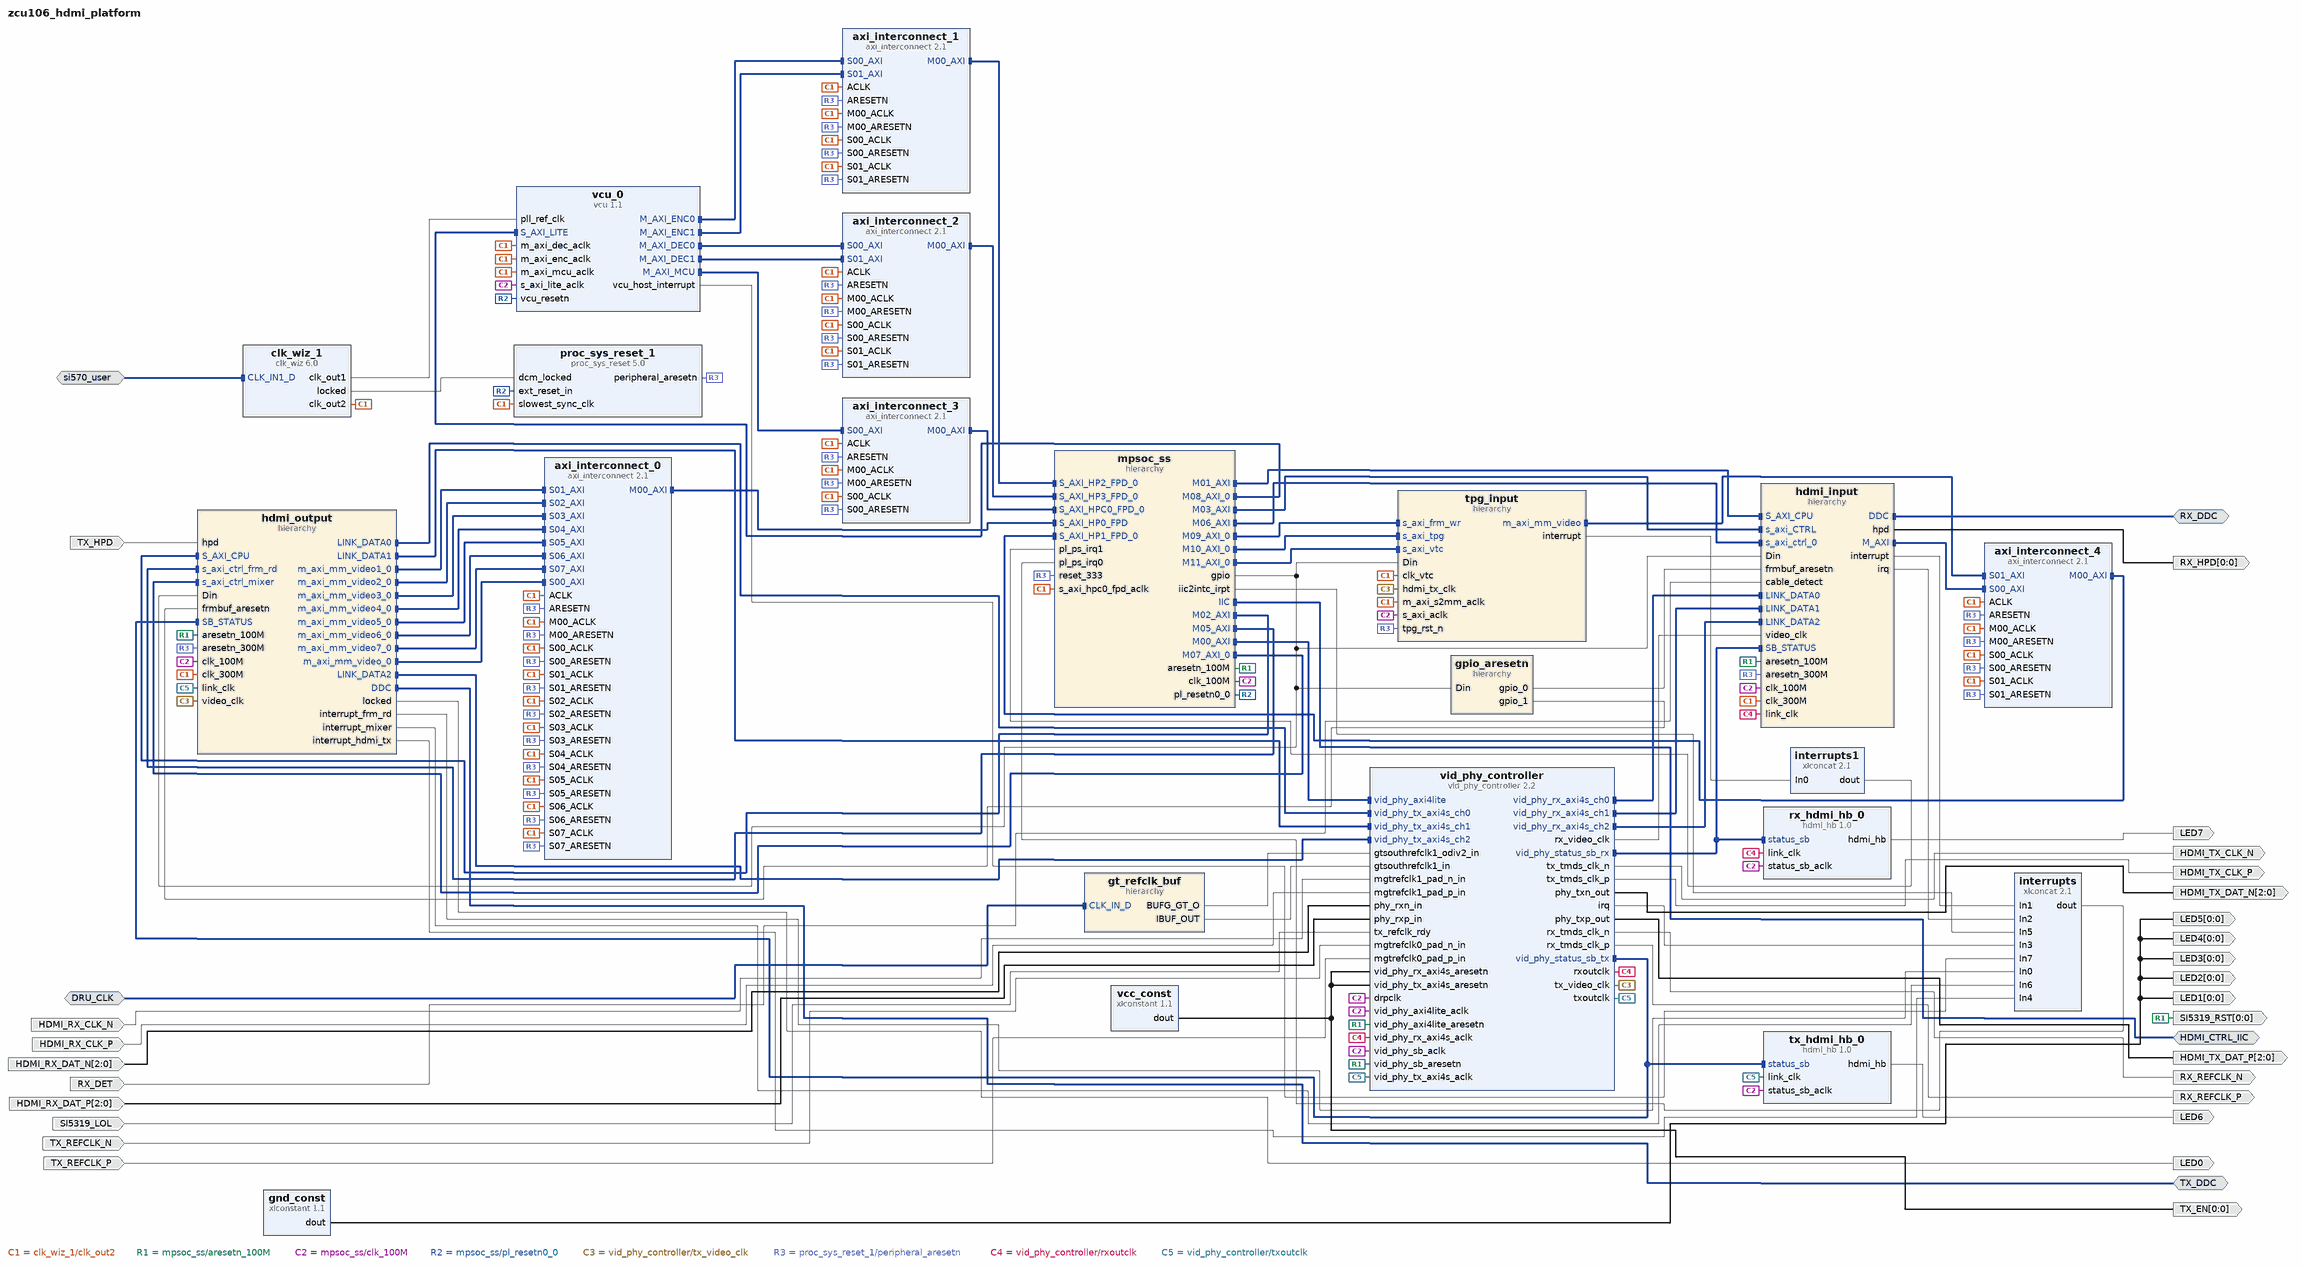
[diagram p0: block diagram of the top level]
# Vivado block design zcu106_hdmi_platform, xczu7ev-ffvc1156-2-e, Vivado 2018.1
create_bd_design zcu106_hdmi_platform

create_bd_intf_port -mode Slave -vlnv xilinx.com:interface:diff_clock_rtl:1.0 DRU_CLK
set_property -dict {CONFIG.FREQ_HZ 156250000} [get_bd_intf_ports DRU_CLK]
create_bd_intf_port -mode Master -vlnv xilinx.com:interface:iic_rtl:1.0 HDMI_CTRL_IIC
create_bd_intf_port -mode Master -vlnv xilinx.com:interface:iic_rtl:1.0 RX_DDC
create_bd_intf_port -mode Master -vlnv xilinx.com:interface:iic_rtl:1.0 TX_DDC
create_bd_intf_port -mode Slave -vlnv xilinx.com:interface:diff_clock_rtl:1.0 si570_user
set_property -dict {CONFIG.FREQ_HZ 300000000} [get_bd_intf_ports si570_user]
create_bd_port -dir I HDMI_RX_CLK_N
create_bd_port -dir I HDMI_RX_CLK_P
create_bd_port -dir I -from 2 -to 0 HDMI_RX_DAT_N
create_bd_port -dir I -from 2 -to 0 HDMI_RX_DAT_P
create_bd_port -dir O HDMI_TX_CLK_N
create_bd_port -dir O HDMI_TX_CLK_P
create_bd_port -dir O -from 2 -to 0 HDMI_TX_DAT_N
create_bd_port -dir O -from 2 -to 0 HDMI_TX_DAT_P
create_bd_port -dir O LED0
create_bd_port -dir O -from 0 -to 0 LED1
create_bd_port -dir O -from 0 -to 0 LED2
create_bd_port -dir O -from 0 -to 0 LED3
create_bd_port -dir O -from 0 -to 0 LED4
create_bd_port -dir O -from 0 -to 0 LED5
create_bd_port -dir O LED6
create_bd_port -dir O LED7
create_bd_port -dir I RX_DET
create_bd_port -dir O -from 0 -to 0 RX_HPD
create_bd_port -dir O RX_REFCLK_N
create_bd_port -dir O RX_REFCLK_P
create_bd_port -dir I SI5319_LOL
create_bd_port -dir O -from 0 -to 0 SI5319_RST
create_bd_port -dir O -from 0 -to 0 TX_EN
create_bd_port -dir I TX_HPD
create_bd_port -dir I TX_REFCLK_N
create_bd_port -dir I TX_REFCLK_P

create_bd_cell -type ip -vlnv xilinx.com:ip:axi_interconnect:2.1 axi_interconnect_0
set_property -dict {CONFIG.NUM_SI 8 CONFIG.NUM_MI 1} [get_bd_cells axi_interconnect_0]
create_bd_cell -type ip -vlnv xilinx.com:ip:axi_interconnect:2.1 axi_interconnect_1
set_property -dict [list \
  CONFIG.NUM_SI 2 \
  CONFIG.NUM_MI 1 \
  CONFIG.M00_HAS_REGSLICE 4 \
  CONFIG.S00_HAS_REGSLICE 4 \
  CONFIG.S01_HAS_REGSLICE 4 \
] [get_bd_cells axi_interconnect_1]
create_bd_cell -type ip -vlnv xilinx.com:ip:axi_interconnect:2.1 axi_interconnect_2
set_property -dict [list \
  CONFIG.NUM_SI 2 \
  CONFIG.NUM_MI 1 \
  CONFIG.M00_HAS_REGSLICE 4 \
  CONFIG.S00_HAS_REGSLICE 4 \
  CONFIG.S01_HAS_REGSLICE 4 \
] [get_bd_cells axi_interconnect_2]
create_bd_cell -type ip -vlnv xilinx.com:ip:axi_interconnect:2.1 axi_interconnect_3
set_property -dict [list \
  CONFIG.NUM_SI 1 \
  CONFIG.NUM_MI 1 \
  CONFIG.M00_HAS_REGSLICE 4 \
  CONFIG.S00_HAS_REGSLICE 4 \
  CONFIG.S01_HAS_REGSLICE 4 \
] [get_bd_cells axi_interconnect_3]
create_bd_cell -type ip -vlnv xilinx.com:ip:axi_interconnect:2.1 axi_interconnect_4
set_property -dict [list \
  CONFIG.NUM_SI 2 \
  CONFIG.NUM_MI 1 \
  CONFIG.M00_HAS_REGSLICE 4 \
  CONFIG.S00_HAS_REGSLICE 4 \
  CONFIG.S01_HAS_REGSLICE 4 \
] [get_bd_cells axi_interconnect_4]
create_bd_cell -type ip -vlnv xilinx.com:ip:clk_wiz:6.0 clk_wiz_1
set_property -dict [list \
  CONFIG.ENABLE_CLOCK_MONITOR false \
  CONFIG.PRIMITIVE MMCM \
  CONFIG.USE_PHASE_ALIGNMENT true \
  CONFIG.PRIM_IN_FREQ 300.000 \
  CONFIG.USE_INCLK_SWITCHOVER false \
  CONFIG.SECONDARY_SOURCE Single_ended_clock_capable_pin \
  CONFIG.JITTER_OPTIONS PS \
  CONFIG.CLKIN1_UI_JITTER 100.000 \
  CONFIG.CLKIN2_UI_JITTER 100.000 \
  CONFIG.CLKIN1_JITTER_PS 100.000 \
  CONFIG.CLKIN2_JITTER_PS 100.000 \
  CONFIG.CLKOUT2_USED true \
  CONFIG.CLKOUT3_USED true \
  CONFIG.NUM_OUT_CLKS 3 \
  CONFIG.CLKOUT1_REQUESTED_OUT_FREQ 33.33 \
  CONFIG.CLKOUT2_REQUESTED_OUT_FREQ 330 \
  CONFIG.CLKOUT3_REQUESTED_OUT_FREQ 200.000 \
  CONFIG.PRIM_SOURCE Differential_clock_capable_pin \
  CONFIG.USE_RESET false \
  CONFIG.MMCM_DIVCLK_DIVIDE 29 \
  CONFIG.MMCM_CLKFBOUT_MULT_F 96.250 \
  CONFIG.MMCM_CLKIN1_PERIOD 3.333 \
  CONFIG.MMCM_CLKIN2_PERIOD 10.0 \
  CONFIG.MMCM_REF_JITTER1 0.030 \
  CONFIG.MMCM_REF_JITTER2 0.010 \
  CONFIG.MMCM_CLKOUT0_DIVIDE_F 29.875 \
  CONFIG.MMCM_CLKOUT1_DIVIDE 3 \
  CONFIG.MMCM_CLKOUT2_DIVIDE 5 \
  CONFIG.CLKOUT1_JITTER 354.447 \
  CONFIG.CLKOUT1_PHASE_ERROR 467.254 \
  CONFIG.CLKOUT2_JITTER 261.654 \
  CONFIG.CLKOUT2_PHASE_ERROR 467.254 \
  CONFIG.CLKOUT3_JITTER 277.891 \
  CONFIG.CLKOUT3_PHASE_ERROR 467.254 \
] [get_bd_cells clk_wiz_1]
create_bd_cell -type ip -vlnv xilinx.com:ip:xlconstant:1.1 gnd_const
set_property -dict {CONFIG.CONST_VAL 0} [get_bd_cells gnd_const]
create_bd_cell -type hier gpio_aresetn
create_bd_cell -type hier gt_refclk_buf
create_bd_cell -type hier hdmi_input
create_bd_cell -type hier hdmi_output
create_bd_cell -type ip -vlnv xilinx.com:ip:xlconcat:2.1 interrupts
set_property -dict {CONFIG.NUM_PORTS 8} [get_bd_cells interrupts]
create_bd_cell -type ip -vlnv xilinx.com:ip:xlconcat:2.1 interrupts1
set_property -dict {CONFIG.NUM_PORTS 1} [get_bd_cells interrupts1]
create_bd_cell -type hier mpsoc_ss
create_bd_cell -type ip -vlnv xilinx.com:ip:proc_sys_reset:5.0 proc_sys_reset_1
create_bd_cell -type ip -vlnv xilinx.com:user:hdmi_hb:1.0 rx_hdmi_hb_0
create_bd_cell -type hier tpg_input
create_bd_cell -type ip -vlnv xilinx.com:user:hdmi_hb:1.0 tx_hdmi_hb_0
create_bd_cell -type ip -vlnv xilinx.com:ip:xlconstant:1.1 vcc_const
set_property -dict {CONFIG.CONST_VAL 1} [get_bd_cells vcc_const]
create_bd_cell -type ip -vlnv xilinx.com:ip:vcu:1.1 vcu_0
set_property -dict [list \
  CONFIG.ENC_CODING_TYPE 1 \
  CONFIG.ENC_COLOR_FORMAT 0 \
  CONFIG.ENC_COLOR_DEPTH 0 \
  CONFIG.ENC_BUFFER_EN true \
  CONFIG.ENC_BUFFER_SIZE_ACTUAL 1445 \
  CONFIG.ENC_BUFFER_MOTION_VEC_RANGE 1 \
  CONFIG.ENC_BUFFER_B_FRAME 1 \
  CONFIG.ENC_MEM_URAM_USED 1445 \
  CONFIG.TABLE_NO 2 \
] [get_bd_cells vcu_0]
create_bd_cell -type ip -vlnv xilinx.com:ip:vid_phy_controller:2.2 vid_phy_controller
set_property -dict [list \
  CONFIG.CHANNEL_ENABLE {X0Y0 X0Y1 X0Y2} \
  CONFIG.CHANNEL_SITE X0Y0 \
  CONFIG.Tx_GT_Line_Rate 5.94 \
  CONFIG.Tx_GT_Ref_Clock_Freq 297 \
  CONFIG.Rx_GT_Line_Rate 5.94 \
  CONFIG.Rx_GT_Ref_Clock_Freq 297 \
  CONFIG.C_Tx_Protocol HDMI \
  CONFIG.C_Rx_Protocol HDMI \
  CONFIG.C_TX_REFCLK_SEL 0 \
  CONFIG.C_RX_REFCLK_SEL 1 \
  CONFIG.C_NIDRU_REFCLK_SEL 5 \
  CONFIG.C_TX_PLL_SELECTION 6 \
  CONFIG.C_RX_PLL_SELECTION 0 \
  CONFIG.C_NIDRU true \
  CONFIG.C_vid_phy_tx_axi4s_ch_TDATA_WIDTH 20 \
  CONFIG.C_vid_phy_tx_axi4s_ch_INT_TDATA_WIDTH 20 \
  CONFIG.C_vid_phy_tx_axi4s_ch_TUSER_WIDTH 1 \
  CONFIG.C_vid_phy_rx_axi4s_ch_TDATA_WIDTH 20 \
  CONFIG.C_vid_phy_rx_axi4s_ch_INT_TDATA_WIDTH 20 \
  CONFIG.C_vid_phy_rx_axi4s_ch_TUSER_WIDTH 1 \
  CONFIG.C_INPUT_PIXELS_PER_CLOCK 2 \
  CONFIG.C_Use_Oddr_for_Tmds_Clkout true \
  CONFIG.C_Txrefclk_Rdy_Invert true \
  CONFIG.C_INT_HDMI_VER_CMPTBLE 3 \
  CONFIG.C_FOR_UPGRADE_ARCHITECTURE placeholder \
  CONFIG.C_FOR_UPGRADE_DEVICE placeholder \
  CONFIG.C_FOR_UPGRADE_PART placeholder \
  CONFIG.C_FOR_UPGRADE_PACKAGE placeholder \
  CONFIG.C_FOR_UPGRADE_SPEEDGRADE 0 \
  CONFIG.C_FOR_UPGRADE_MAXOPTVOL 0.00 \
  CONFIG.C_FOR_UPGRADE_REFVOL 0.00 \
] [get_bd_cells vid_phy_controller]

# ---- hierarchy /gpio_aresetn ----
current_bd_instance /gpio_aresetn
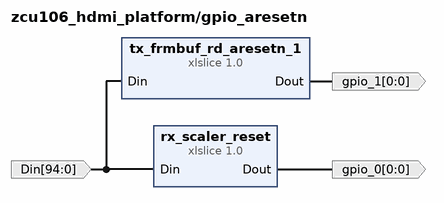
[diagram p1: block diagram inside /gpio_aresetn]
create_bd_pin -dir I -from 94 -to 0 Din
create_bd_pin -dir O -from 0 -to 0 -type rst gpio_0
create_bd_pin -dir O -from 0 -to 0 gpio_1

create_bd_cell -type ip -vlnv xilinx.com:ip:xlslice:1.0 rx_scaler_reset
set_property -dict {CONFIG.DIN_TO 0 CONFIG.DIN_FROM 0 CONFIG.DIN_WIDTH 95 CONFIG.DOUT_WIDTH 1} [get_bd_cells rx_scaler_reset]
create_bd_cell -type ip -vlnv xilinx.com:ip:xlslice:1.0 tx_frmbuf_rd_aresetn_1
set_property -dict [list \
  CONFIG.DIN_TO 1 \
  CONFIG.DIN_FROM 1 \
  CONFIG.DIN_WIDTH 95 \
  CONFIG.DOUT_WIDTH 1 \
] [get_bd_cells tx_frmbuf_rd_aresetn_1]

# ---- hierarchy /gt_refclk_buf ----
current_bd_instance /gt_refclk_buf
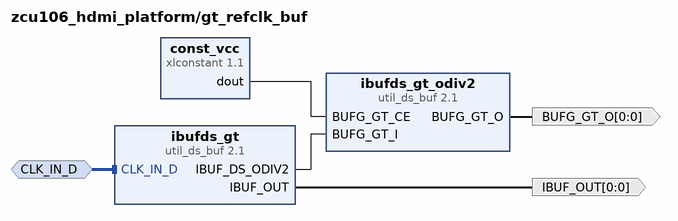
[diagram p2: block diagram inside /gt_refclk_buf]
create_bd_intf_pin -mode Slave -vlnv xilinx.com:interface:diff_clock_rtl:1.0 CLK_IN_D
create_bd_pin -dir O -from 0 -to 0 -type clk BUFG_GT_O
create_bd_pin -dir O -from 0 -to 0 -type clk IBUF_OUT

create_bd_cell -type ip -vlnv xilinx.com:ip:xlconstant:1.1 const_vcc
create_bd_cell -type ip -vlnv xilinx.com:ip:util_ds_buf:2.1 ibufds_gt
set_property -dict {CONFIG.C_BUF_TYPE IBUFDSGTE} [get_bd_cells ibufds_gt]
create_bd_cell -type ip -vlnv xilinx.com:ip:util_ds_buf:2.1 ibufds_gt_odiv2
set_property -dict {CONFIG.C_BUF_TYPE BUFG_GT} [get_bd_cells ibufds_gt_odiv2]

# ---- hierarchy /hdmi_input ----
current_bd_instance /hdmi_input
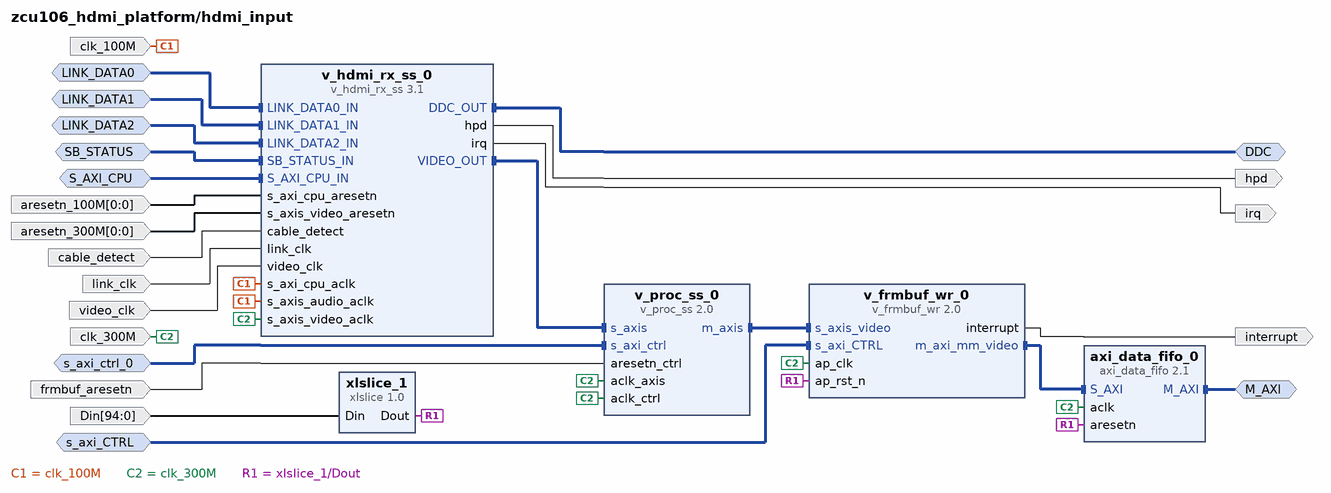
[diagram p3: block diagram inside /hdmi_input]
create_bd_intf_pin -mode Master -vlnv xilinx.com:interface:iic_rtl:1.0 DDC
create_bd_intf_pin -mode Slave -vlnv xilinx.com:interface:axis_rtl:1.0 LINK_DATA0
create_bd_intf_pin -mode Slave -vlnv xilinx.com:interface:axis_rtl:1.0 LINK_DATA1
create_bd_intf_pin -mode Slave -vlnv xilinx.com:interface:axis_rtl:1.0 LINK_DATA2
create_bd_intf_pin -mode Master -vlnv xilinx.com:interface:aximm_rtl:1.0 M_AXI
create_bd_intf_pin -mode Slave -vlnv xilinx.com:interface:axis_rtl:1.0 SB_STATUS
create_bd_intf_pin -mode Slave -vlnv xilinx.com:interface:aximm_rtl:1.0 S_AXI_CPU
create_bd_intf_pin -mode Slave -vlnv xilinx.com:interface:aximm_rtl:1.0 s_axi_CTRL
create_bd_intf_pin -mode Slave -vlnv xilinx.com:interface:aximm_rtl:1.0 s_axi_ctrl_0
create_bd_pin -dir I -from 94 -to 0 Din
create_bd_pin -dir I -from 0 -to 0 -type rst aresetn_100M
create_bd_pin -dir I -from 0 -to 0 -type rst aresetn_300M
create_bd_pin -dir I cable_detect
create_bd_pin -dir I -type clk clk_100M
create_bd_pin -dir I -type clk clk_300M
create_bd_pin -dir I -type rst frmbuf_aresetn
create_bd_pin -dir O hpd
create_bd_pin -dir O -type intr interrupt
create_bd_pin -dir O -type intr irq
create_bd_pin -dir I -type clk link_clk
create_bd_pin -dir I -type clk video_clk

create_bd_cell -type ip -vlnv xilinx.com:ip:axi_data_fifo:2.1 axi_data_fifo_0
set_property -dict {CONFIG.WRITE_FIFO_DEPTH 512 CONFIG.WRITE_FIFO_DELAY 1} [get_bd_cells axi_data_fifo_0]
create_bd_cell -type ip -vlnv xilinx.com:ip:v_frmbuf_wr:2.0 v_frmbuf_wr_0
set_property -dict [list \
  CONFIG.C_M_AXI_MM_VIDEO_DATA_WIDTH 128 \
  CONFIG.SAMPLES_PER_CLOCK 2 \
  CONFIG.MAX_DATA_WIDTH 8 \
  CONFIG.AXIMM_DATA_WIDTH 128 \
  CONFIG.AXIMM_ADDR_WIDTH 64 \
  CONFIG.HAS_RGBX8 1 \
  CONFIG.HAS_YUVX8 1 \
  CONFIG.HAS_YUYV8 1 \
  CONFIG.HAS_Y_UV8 1 \
  CONFIG.HAS_Y_UV8_420 1 \
  CONFIG.HAS_YUV8 1 \
  CONFIG.HAS_Y8 1 \
  CONFIG.HAS_BGRX8 1 \
  CONFIG.HAS_UYVY8 1 \
  CONFIG.MAX_NR_PLANES 2 \
] [get_bd_cells v_frmbuf_wr_0]
create_bd_cell -type ip -vlnv xilinx.com:ip:v_hdmi_rx_ss:3.1 v_hdmi_rx_ss_0
set_property -dict [list \
  CONFIG.C_MAX_BITS_PER_COMPONENT 8 \
  CONFIG.C_INPUT_PIXELS_PER_CLOCK 2 \
  CONFIG.C_INCLUDE_YUV420_SUP true \
  CONFIG.C_HDMI_FAST_SWITCH true \
  CONFIG.C_CD_INVERT true \
] [get_bd_cells v_hdmi_rx_ss_0]
create_bd_cell -type ip -vlnv xilinx.com:ip:v_proc_ss:2.0 v_proc_ss_0
set_property -dict [list \
  CONFIG.C_TOPOLOGY 0 \
  CONFIG.C_MAX_DATA_WIDTH 8 \
  CONFIG.C_H_SCALER_TAPS 8 \
  CONFIG.C_V_SCALER_TAPS 8 \
  CONFIG.C_ENABLE_CSC true \
] [get_bd_cells v_proc_ss_0]
create_bd_cell -type ip -vlnv xilinx.com:ip:xlslice:1.0 xlslice_1
set_property -dict {CONFIG.DIN_TO 15 CONFIG.DIN_FROM 15 CONFIG.DIN_WIDTH 95 CONFIG.DOUT_WIDTH 1} [get_bd_cells xlslice_1]

# ---- hierarchy /hdmi_output ----
current_bd_instance /hdmi_output
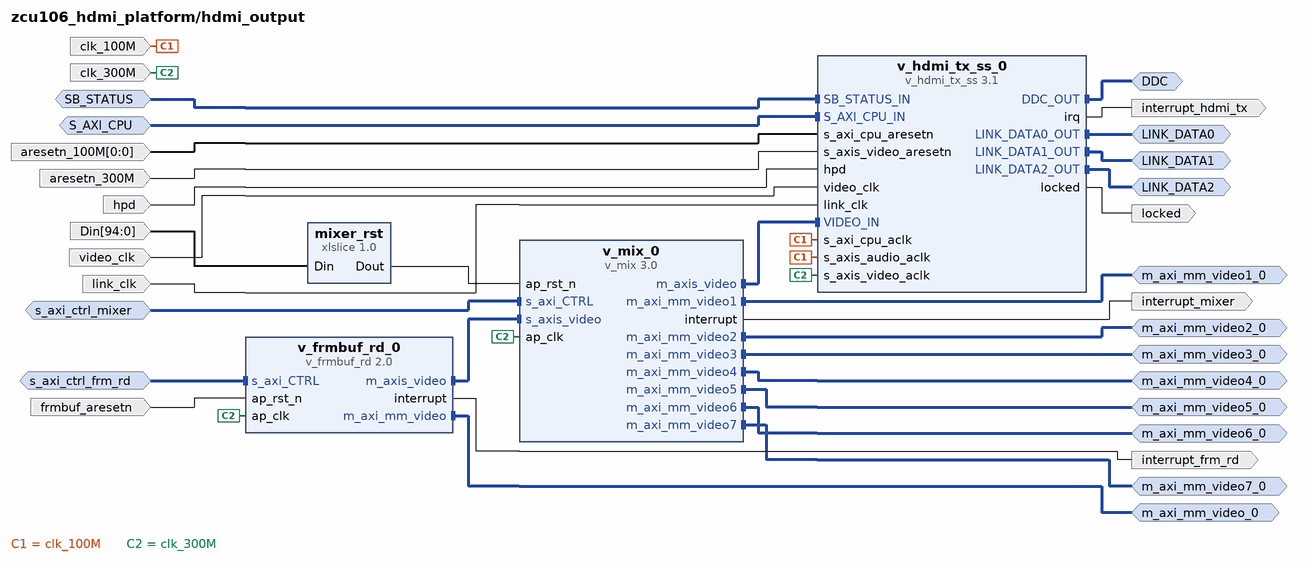
[diagram p4: block diagram inside /hdmi_output]
create_bd_intf_pin -mode Master -vlnv xilinx.com:interface:iic_rtl:1.0 DDC
create_bd_intf_pin -mode Master -vlnv xilinx.com:interface:axis_rtl:1.0 LINK_DATA0
create_bd_intf_pin -mode Master -vlnv xilinx.com:interface:axis_rtl:1.0 LINK_DATA1
create_bd_intf_pin -mode Master -vlnv xilinx.com:interface:axis_rtl:1.0 LINK_DATA2
create_bd_intf_pin -mode Slave -vlnv xilinx.com:interface:axis_rtl:1.0 SB_STATUS
create_bd_intf_pin -mode Slave -vlnv xilinx.com:interface:aximm_rtl:1.0 S_AXI_CPU
create_bd_intf_pin -mode Master -vlnv xilinx.com:interface:aximm_rtl:1.0 m_axi_mm_video1_0
create_bd_intf_pin -mode Master -vlnv xilinx.com:interface:aximm_rtl:1.0 m_axi_mm_video2_0
create_bd_intf_pin -mode Master -vlnv xilinx.com:interface:aximm_rtl:1.0 m_axi_mm_video3_0
create_bd_intf_pin -mode Master -vlnv xilinx.com:interface:aximm_rtl:1.0 m_axi_mm_video4_0
create_bd_intf_pin -mode Master -vlnv xilinx.com:interface:aximm_rtl:1.0 m_axi_mm_video5_0
create_bd_intf_pin -mode Master -vlnv xilinx.com:interface:aximm_rtl:1.0 m_axi_mm_video6_0
create_bd_intf_pin -mode Master -vlnv xilinx.com:interface:aximm_rtl:1.0 m_axi_mm_video7_0
create_bd_intf_pin -mode Master -vlnv xilinx.com:interface:aximm_rtl:1.0 m_axi_mm_video_0
create_bd_intf_pin -mode Slave -vlnv xilinx.com:interface:aximm_rtl:1.0 s_axi_ctrl_frm_rd
create_bd_intf_pin -mode Slave -vlnv xilinx.com:interface:aximm_rtl:1.0 s_axi_ctrl_mixer
create_bd_pin -dir I -from 94 -to 0 Din
create_bd_pin -dir I -from 0 -to 0 -type rst aresetn_100M
create_bd_pin -dir I -type rst aresetn_300M
create_bd_pin -dir I -type clk clk_100M
create_bd_pin -dir I -type clk clk_300M
create_bd_pin -dir I -type rst frmbuf_aresetn
create_bd_pin -dir I hpd
create_bd_pin -dir O -type intr interrupt_frm_rd
create_bd_pin -dir O -type intr interrupt_hdmi_tx
create_bd_pin -dir O -type intr interrupt_mixer
create_bd_pin -dir I -type clk link_clk
create_bd_pin -dir O locked
create_bd_pin -dir I -type clk video_clk

create_bd_cell -type ip -vlnv xilinx.com:ip:xlslice:1.0 mixer_rst
set_property -dict {CONFIG.DIN_TO 20 CONFIG.DIN_FROM 20 CONFIG.DIN_WIDTH 95 CONFIG.DOUT_WIDTH 1} [get_bd_cells mixer_rst]
create_bd_cell -type ip -vlnv xilinx.com:ip:v_frmbuf_rd:2.0 v_frmbuf_rd_0
set_property -dict [list \
  CONFIG.MAX_DATA_WIDTH 8 \
  CONFIG.AXIMM_ADDR_WIDTH 64 \
  CONFIG.HAS_RGBX8 1 \
  CONFIG.HAS_YUVX8 1 \
  CONFIG.HAS_YUYV8 1 \
  CONFIG.HAS_Y_UV8 1 \
  CONFIG.HAS_Y_UV8_420 1 \
  CONFIG.HAS_YUV8 1 \
  CONFIG.HAS_Y8 1 \
  CONFIG.HAS_BGRX8 1 \
  CONFIG.HAS_UYVY8 1 \
  CONFIG.MAX_NR_PLANES 2 \
] [get_bd_cells v_frmbuf_rd_0]
create_bd_cell -type ip -vlnv xilinx.com:ip:v_hdmi_tx_ss:3.1 v_hdmi_tx_ss_0
set_property -dict [list \
  CONFIG.C_MAX_BITS_PER_COMPONENT 8 \
  CONFIG.C_INPUT_PIXELS_PER_CLOCK 2 \
  CONFIG.C_VID_INTERFACE 0 \
  CONFIG.C_INCLUDE_YUV420_SUP true \
  CONFIG.C_HDMI_FAST_SWITCH true \
] [get_bd_cells v_hdmi_tx_ss_0]
create_bd_cell -type ip -vlnv xilinx.com:ip:v_mix:3.0 v_mix_0
set_property -dict [list \
  CONFIG.SAMPLES_PER_CLOCK 2 \
  CONFIG.NR_LAYERS 8 \
  CONFIG.LAYER1_VIDEO_FORMAT 19 \
  CONFIG.LAYER2_VIDEO_FORMAT 19 \
  CONFIG.LAYER3_VIDEO_FORMAT 19 \
  CONFIG.LAYER4_VIDEO_FORMAT 19 \
  CONFIG.LAYER5_VIDEO_FORMAT 19 \
  CONFIG.LAYER6_VIDEO_FORMAT 19 \
  CONFIG.LAYER7_VIDEO_FORMAT 26 \
  CONFIG.AXIMM_ADDR_WIDTH 64 \
  CONFIG.AXIMM_NUM_OUTSTANDING 16 \
] [get_bd_cells v_mix_0]

# ---- hierarchy /mpsoc_ss ----
current_bd_instance /mpsoc_ss
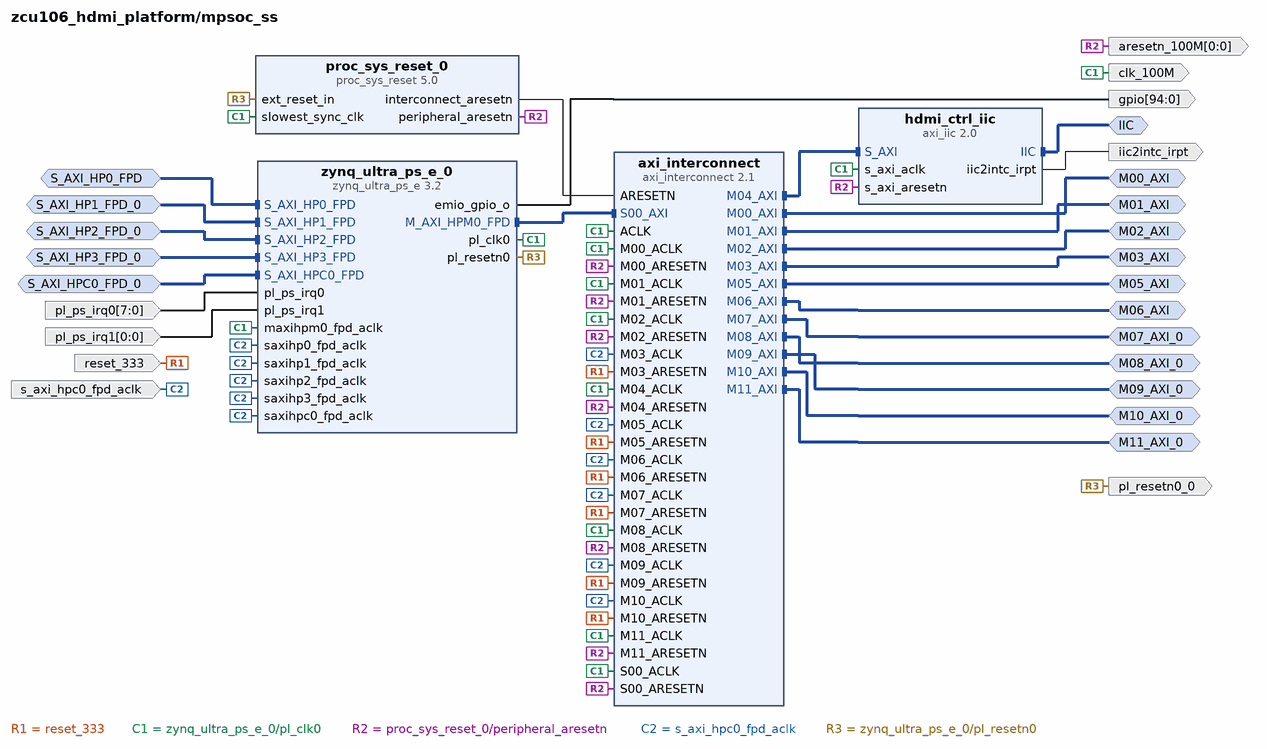
[diagram p5: block diagram inside /mpsoc_ss]
create_bd_intf_pin -mode Master -vlnv xilinx.com:interface:iic_rtl:1.0 IIC
create_bd_intf_pin -mode Master -vlnv xilinx.com:interface:aximm_rtl:1.0 M00_AXI
create_bd_intf_pin -mode Master -vlnv xilinx.com:interface:aximm_rtl:1.0 M01_AXI
create_bd_intf_pin -mode Master -vlnv xilinx.com:interface:aximm_rtl:1.0 M02_AXI
create_bd_intf_pin -mode Master -vlnv xilinx.com:interface:aximm_rtl:1.0 M03_AXI
create_bd_intf_pin -mode Master -vlnv xilinx.com:interface:aximm_rtl:1.0 M05_AXI
create_bd_intf_pin -mode Master -vlnv xilinx.com:interface:aximm_rtl:1.0 M06_AXI
create_bd_intf_pin -mode Master -vlnv xilinx.com:interface:aximm_rtl:1.0 M07_AXI_0
create_bd_intf_pin -mode Master -vlnv xilinx.com:interface:aximm_rtl:1.0 M08_AXI_0
create_bd_intf_pin -mode Master -vlnv xilinx.com:interface:aximm_rtl:1.0 M09_AXI_0
create_bd_intf_pin -mode Master -vlnv xilinx.com:interface:aximm_rtl:1.0 M10_AXI_0
create_bd_intf_pin -mode Master -vlnv xilinx.com:interface:aximm_rtl:1.0 M11_AXI_0
create_bd_intf_pin -mode Slave -vlnv xilinx.com:interface:aximm_rtl:1.0 S_AXI_HP0_FPD
create_bd_intf_pin -mode Slave -vlnv xilinx.com:interface:aximm_rtl:1.0 S_AXI_HP1_FPD_0
create_bd_intf_pin -mode Slave -vlnv xilinx.com:interface:aximm_rtl:1.0 S_AXI_HP2_FPD_0
create_bd_intf_pin -mode Slave -vlnv xilinx.com:interface:aximm_rtl:1.0 S_AXI_HP3_FPD_0
create_bd_intf_pin -mode Slave -vlnv xilinx.com:interface:aximm_rtl:1.0 S_AXI_HPC0_FPD_0
create_bd_pin -dir O -from 0 -to 0 -type rst aresetn_100M
create_bd_pin -dir O -type clk clk_100M
create_bd_pin -dir O -from 94 -to 0 gpio
create_bd_pin -dir O -type intr iic2intc_irpt
create_bd_pin -dir I -from 7 -to 0 -type intr pl_ps_irq0
create_bd_pin -dir I -from 0 -to 0 -type intr pl_ps_irq1
create_bd_pin -dir O -type rst pl_resetn0_0
create_bd_pin -dir I -type rst reset_333
create_bd_pin -dir I -type clk s_axi_hpc0_fpd_aclk

create_bd_cell -type ip -vlnv xilinx.com:ip:axi_interconnect:2.1 axi_interconnect
set_property -dict {CONFIG.NUM_MI 12} [get_bd_cells axi_interconnect]
create_bd_cell -type ip -vlnv xilinx.com:ip:axi_iic:2.0 hdmi_ctrl_iic
set_property -dict {CONFIG.USE_BOARD_FLOW true CONFIG.IIC_BOARD_INTERFACE Custom} [get_bd_cells hdmi_ctrl_iic]
create_bd_cell -type ip -vlnv xilinx.com:ip:proc_sys_reset:5.0 proc_sys_reset_0
create_bd_cell -type ip -vlnv xilinx.com:ip:zynq_ultra_ps_e:3.2 zynq_ultra_ps_e_0
set_property -dict [list \
  CONFIG.PSU__PSS_REF_CLK__FREQMHZ 33.330 \
  CONFIG.PSU__CAN1__PERIPHERAL__ENABLE 1 \
  CONFIG.PSU__CAN1__PERIPHERAL__IO {MIO 24 .. 25} \
  CONFIG.PSU__DPAUX__PERIPHERAL__ENABLE 1 \
  CONFIG.PSU__DPAUX__PERIPHERAL__IO {MIO 27 .. 30} \
  CONFIG.PSU__GEM__TSU__ENABLE 0 \
  CONFIG.PSU__FPGA_PL0_ENABLE 1 \
  CONFIG.PSU__FPGA_PL1_ENABLE 1 \
  CONFIG.PSU__ENET3__PERIPHERAL__ENABLE 1 \
  CONFIG.PSU__ENET3__FIFO__ENABLE 0 \
  CONFIG.PSU__ENET3__PTP__ENABLE 0 \
  CONFIG.PSU__ENET3__PERIPHERAL__IO {MIO 64 .. 75} \
  CONFIG.PSU__ENET3__GRP_MDIO__ENABLE 1 \
  CONFIG.PSU__ENET3__GRP_MDIO__IO {MIO 76 .. 77} \
  CONFIG.PSU__GPIO_EMIO__PERIPHERAL__ENABLE 1 \
  CONFIG.PSU__GPIO_EMIO__PERIPHERAL__IO 95 \
  CONFIG.PSU__GPIO0_MIO__PERIPHERAL__ENABLE 1 \
  CONFIG.PSU__GPIO0_MIO__IO {MIO 0 .. 25} \
  CONFIG.PSU__GPIO1_MIO__PERIPHERAL__ENABLE 1 \
  CONFIG.PSU__GPIO1_MIO__IO {MIO 26 .. 51} \
  CONFIG.PSU__I2C0__PERIPHERAL__ENABLE 1 \
  CONFIG.PSU__I2C0__PERIPHERAL__IO {MIO 14 .. 15} \
  CONFIG.PSU__I2C1__PERIPHERAL__ENABLE 1 \
  CONFIG.PSU__I2C1__PERIPHERAL__IO {MIO 16 .. 17} \
  CONFIG.PSU__GT__LINK_SPEED HBR \
  CONFIG.PSU__GT__VLT_SWNG_LVL_4 0 \
  CONFIG.PSU__GT__PRE_EMPH_LVL_4 0 \
  CONFIG.PSU__USB0__REF_CLK_SEL {Ref Clk2} \
  CONFIG.PSU__USB0__REF_CLK_FREQ 26 \
  CONFIG.PSU__DP__REF_CLK_SEL {Ref Clk3} \
  CONFIG.PSU__DP__REF_CLK_FREQ 27 \
  CONFIG.PSU__SATA__REF_CLK_SEL {Ref Clk1} \
  CONFIG.PSU__SATA__REF_CLK_FREQ 125 \
  CONFIG.PSU__DP__LANE_SEL {Dual Lower} \
  CONFIG.SUBPRESET1 Custom \
  CONFIG.SUBPRESET2 Custom \
  CONFIG.PSU__PMU__AIBACK__ENABLE 0 \
  CONFIG.PSU__PMU__PLERROR__ENABLE 0 \
  CONFIG.PSU__PMU__PERIPHERAL__ENABLE 1 \
  CONFIG.PSU__PMU__EMIO_GPI__ENABLE 0 \
  CONFIG.PSU__PMU__EMIO_GPO__ENABLE 0 \
  CONFIG.PSU__PMU__GPI0__ENABLE 0 \
  CONFIG.PSU__PMU__GPI1__ENABLE 0 \
  CONFIG.PSU__PMU__GPI2__ENABLE 0 \
  CONFIG.PSU__PMU__GPI3__ENABLE 0 \
  CONFIG.PSU__PMU__GPI4__ENABLE 0 \
  CONFIG.PSU__PMU__GPI5__ENABLE 0 \
  CONFIG.PSU__PMU__GPO0__ENABLE 1 \
  CONFIG.PSU__PMU__GPO1__ENABLE 1 \
  CONFIG.PSU__PMU__GPO2__ENABLE 1 \
  CONFIG.PSU__PMU__GPO3__ENABLE 1 \
  CONFIG.PSU__PMU__GPO4__ENABLE 1 \
  CONFIG.PSU__PMU__GPO5__ENABLE 1 \
  CONFIG.PSU__PMU__GPO0__IO {MIO 32} \
  CONFIG.PSU__PMU__GPO1__IO {MIO 33} \
  CONFIG.PSU__PMU__GPO2__IO {MIO 34} \
  CONFIG.PSU__PMU__GPO3__IO {MIO 35} \
  CONFIG.PSU__PMU__GPO4__IO {MIO 36} \
  CONFIG.PSU__PMU__GPO5__IO {MIO 37} \
  CONFIG.PSU__PMU__GPO2__POLARITY low \
  CONFIG.PSU__PMU__GPO3__POLARITY low \
  CONFIG.PSU__PMU__GPO4__POLARITY low \
  CONFIG.PSU__PMU__GPO5__POLARITY low \
  CONFIG.PSU__QSPI__PERIPHERAL__ENABLE 1 \
  CONFIG.PSU__QSPI__PERIPHERAL__IO {MIO 0 .. 12} \
  CONFIG.PSU__QSPI__PERIPHERAL__MODE {Dual Parallel} \
  CONFIG.PSU__QSPI__PERIPHERAL__DATA_MODE x4 \
  CONFIG.PSU__QSPI__GRP_FBCLK__ENABLE 1 \
  CONFIG.PSU__QSPI__GRP_FBCLK__IO {MIO 6} \
  CONFIG.PSU__SD1__PERIPHERAL__ENABLE 1 \
  CONFIG.PSU__SD1__PERIPHERAL__IO {MIO 39 .. 51} \
  CONFIG.PSU__SD1__GRP_CD__ENABLE 1 \
  CONFIG.PSU__SD1__GRP_CD__IO {MIO 45} \
  CONFIG.PSU__SD1__GRP_POW__ENABLE 1 \
  CONFIG.PSU__SD1__GRP_POW__IO {MIO 43} \
  CONFIG.PSU__SD1__GRP_WP__ENABLE 1 \
  CONFIG.PSU__SD1__GRP_WP__IO {MIO 44} \
  CONFIG.PSU__SD1__SLOT_TYPE {SD 3.0} \
  CONFIG.PSU__SD1__DATA_TRANSFER_MODE 8Bit \
  CONFIG.PSU__DEVICE_TYPE EV \
  CONFIG.PSU__SWDT0__PERIPHERAL__ENABLE 1 \
  CONFIG.PSU__SWDT0__CLOCK__ENABLE 0 \
  CONFIG.PSU__SWDT0__RESET__ENABLE 0 \
  CONFIG.PSU__SWDT1__PERIPHERAL__ENABLE 1 \
  CONFIG.PSU__SWDT1__CLOCK__ENABLE 0 \
  CONFIG.PSU__SWDT1__RESET__ENABLE 0 \
  CONFIG.PSU__UART0__BAUD_RATE 115200 \
  CONFIG.PSU__TTC0__PERIPHERAL__ENABLE 1 \
  CONFIG.PSU__TTC0__CLOCK__ENABLE 0 \
  CONFIG.PSU__TTC0__WAVEOUT__ENABLE 0 \
  CONFIG.PSU__TTC1__PERIPHERAL__ENABLE 1 \
  CONFIG.PSU__UART1__BAUD_RATE 115200 \
  CONFIG.PSU__TTC1__CLOCK__ENABLE 0 \
  CONFIG.PSU__TTC1__WAVEOUT__ENABLE 0 \
  CONFIG.PSU__TTC2__PERIPHERAL__ENABLE 1 \
  CONFIG.PSU__TTC2__CLOCK__ENABLE 0 \
  CONFIG.PSU__TTC2__WAVEOUT__ENABLE 0 \
  CONFIG.PSU__TTC3__PERIPHERAL__ENABLE 1 \
  CONFIG.PSU__TTC3__CLOCK__ENABLE 0 \
  CONFIG.PSU__TTC3__WAVEOUT__ENABLE 0 \
  CONFIG.PSU__CSUPMU__PERIPHERAL__VALID 1 \
  CONFIG.PSU__DDRC__BUS_WIDTH {64 Bit} \
  CONFIG.PSU__DDRC__DEVICE_CAPACITY {4096 MBits} \
  CONFIG.PSU__DDRC__DRAM_WIDTH {8 Bits} \
  CONFIG.PSU__DDRC__ECC Disabled \
  CONFIG.PSU__DDRC__MEMORY_TYPE {DDR 4} \
  CONFIG.PSU__DDRC__SPEED_BIN DDR4_2133P \
  CONFIG.PSU__DDRC__COMPONENTS UDIMM \
  CONFIG.PSU__UART0__PERIPHERAL__ENABLE 1 \
  CONFIG.PSU__UART0__PERIPHERAL__IO {MIO 18 .. 19} \
  CONFIG.PSU__UART0__MODEM__ENABLE 0 \
  CONFIG.PSU__UART1__PERIPHERAL__ENABLE 1 \
  CONFIG.PSU__UART1__PERIPHERAL__IO {MIO 20 .. 21} \
  CONFIG.PSU__UART1__MODEM__ENABLE 0 \
  CONFIG.PSU__USB0__PERIPHERAL__ENABLE 1 \
  CONFIG.PSU__USB0__PERIPHERAL__IO {MIO 52 .. 63} \
  CONFIG.PSU__USB3_0__PERIPHERAL__ENABLE 1 \
  CONFIG.PSU__USB3_0__PERIPHERAL__IO {GT Lane2} \
  CONFIG.PSU__USB3_0__EMIO__ENABLE 0 \
  CONFIG.PSU__USB2_0__EMIO__ENABLE 0 \
  CONFIG.PSU__USE__M_AXI_GP0 1 \
  CONFIG.PSU__MAXIGP0__DATA_WIDTH 128 \
  CONFIG.PSU__USE__M_AXI_GP1 0 \
  CONFIG.PSU__USE__M_AXI_GP2 0 \
  CONFIG.PSU__USE__S_AXI_GP0 1 \
  CONFIG.PSU__USE__S_AXI_GP2 1 \
  CONFIG.PSU__USE__S_AXI_GP3 1 \
  CONFIG.PSU__USE__S_AXI_GP4 1 \
  CONFIG.PSU__USE__S_AXI_GP5 1 \
  CONFIG.PSU__USE__IRQ0 1 \
  CONFIG.PSU__USE__IRQ1 1 \
  CONFIG.PSU__PRESET_APPLIED 1 \
  CONFIG.PSU__HIGH_ADDRESS__ENABLE 0 \
  CONFIG.PSU__DDR_HIGH_ADDRESS_GUI_ENABLE 1 \
  CONFIG.PSU_BANK_0_IO_STANDARD LVCMOS18 \
  CONFIG.PSU_BANK_1_IO_STANDARD LVCMOS18 \
  CONFIG.PSU_BANK_2_IO_STANDARD LVCMOS18 \
  CONFIG.PSU_BANK_3_IO_STANDARD LVCMOS33 \
  CONFIG.PSU__DISPLAYPORT__PERIPHERAL__ENABLE 1 \
  CONFIG.PSU__DISPLAYPORT__LANE0__ENABLE 1 \
  CONFIG.PSU__DISPLAYPORT__LANE0__IO {GT Lane1} \
  CONFIG.PSU__DISPLAYPORT__LANE1__ENABLE 1 \
  CONFIG.PSU__DISPLAYPORT__LANE1__IO {GT Lane0} \
  CONFIG.PSU__SATA__PERIPHERAL__ENABLE 1 \
  CONFIG.PSU__SATA__LANE1__IO {GT Lane3} \
  CONFIG.PSU__CRL_APB__USB3__ENABLE 1 \
  CONFIG.PSU__CRF_APB__APLL_CTRL__SRCSEL PSS_REF_CLK \
  CONFIG.PSU__CRF_APB__DPLL_CTRL__SRCSEL PSS_REF_CLK \
  CONFIG.PSU__CRF_APB__VPLL_CTRL__SRCSEL PSS_REF_CLK \
  CONFIG.PSU__CRF_APB__ACPU_CTRL__SRCSEL APLL \
  CONFIG.PSU__CRF_APB__DBG_TRACE_CTRL__SRCSEL IOPLL \
  CONFIG.PSU__CRF_APB__DBG_FPD_CTRL__SRCSEL IOPLL \
  CONFIG.PSU__CRF_APB__DP_VIDEO_REF_CTRL__SRCSEL VPLL \
  CONFIG.PSU__CRF_APB__DP_AUDIO_REF_CTRL__SRCSEL RPLL \
  CONFIG.PSU__CRF_APB__DP_STC_REF_CTRL__SRCSEL RPLL \
  CONFIG.PSU__CRF_APB__DDR_CTRL__SRCSEL DPLL \
  CONFIG.PSU__CRF_APB__GPU_REF_CTRL__SRCSEL IOPLL \
  CONFIG.PSU__CRL_APB__PL0_REF_CTRL__SRCSEL IOPLL \
  CONFIG.PSU__CRL_APB__PL1_REF_CTRL__SRCSEL IOPLL \
  CONFIG.PSU__CRF_APB__GDMA_REF_CTRL__SRCSEL APLL \
  CONFIG.PSU__CRF_APB__DPDMA_REF_CTRL__SRCSEL APLL \
  CONFIG.PSU__CRF_APB__TOPSW_MAIN_CTRL__SRCSEL DPLL \
  CONFIG.PSU__CRF_APB__TOPSW_LSBUS_CTRL__SRCSEL IOPLL \
  CONFIG.PSU__CRF_APB__DBG_TSTMP_CTRL__SRCSEL IOPLL \
  CONFIG.PSU__CRL_APB__IOPLL_CTRL__SRCSEL PSS_REF_CLK \
  CONFIG.PSU__CRL_APB__RPLL_CTRL__SRCSEL PSS_REF_CLK \
  CONFIG.PSU__CRL_APB__GEM3_REF_CTRL__SRCSEL IOPLL \
  CONFIG.PSU__CRL_APB__USB0_BUS_REF_CTRL__SRCSEL IOPLL \
  CONFIG.PSU__CRL_APB__QSPI_REF_CTRL__SRCSEL IOPLL \
  CONFIG.PSU__CRL_APB__SDIO1_REF_CTRL__SRCSEL IOPLL \
  CONFIG.PSU__CRL_APB__UART0_REF_CTRL__SRCSEL IOPLL \
  CONFIG.PSU__CRL_APB__UART1_REF_CTRL__SRCSEL IOPLL \
  CONFIG.PSU__CRL_APB__I2C0_REF_CTRL__SRCSEL IOPLL \
  CONFIG.PSU__CRL_APB__I2C1_REF_CTRL__SRCSEL IOPLL \
  CONFIG.PSU__CRL_APB__CAN1_REF_CTRL__SRCSEL IOPLL \
  CONFIG.PSU__CRL_APB__CPU_R5_CTRL__SRCSEL IOPLL \
  CONFIG.PSU__CRL_APB__IOU_SWITCH_CTRL__SRCSEL IOPLL \
  CONFIG.PSU__CRL_APB__PCAP_CTRL__SRCSEL IOPLL \
  CONFIG.PSU__CRL_APB__LPD_LSBUS_CTRL__SRCSEL IOPLL \
  CONFIG.PSU__CRL_APB__LPD_SWITCH_CTRL__SRCSEL IOPLL \
  CONFIG.PSU__CRL_APB__DBG_LPD_CTRL__SRCSEL IOPLL \
  CONFIG.PSU__CRL_APB__ADMA_REF_CTRL__SRCSEL IOPLL \
  CONFIG.PSU__CRL_APB__TIMESTAMP_REF_CTRL__SRCSEL IOPLL \
  CONFIG.PSU__CRL_APB__USB3_DUAL_REF_CTRL__SRCSEL IOPLL \
  CONFIG.PSU__IOU_SLCR__IOU_TTC_APB_CLK__TTC0_SEL APB \
  CONFIG.PSU__IOU_SLCR__IOU_TTC_APB_CLK__TTC1_SEL APB \
  CONFIG.PSU__IOU_SLCR__IOU_TTC_APB_CLK__TTC2_SEL APB \
  CONFIG.PSU__IOU_SLCR__IOU_TTC_APB_CLK__TTC3_SEL APB \
  CONFIG.PSU__OVERRIDE__BASIC_CLOCK 0 \
  CONFIG.PSU__DLL__ISUSED 1 \
  CONFIG.PSU__DDR__INTERFACE__FREQMHZ 533.500 \
  CONFIG.PSU__CRF_APB__ACPU_CTRL__FREQMHZ 1200 \
  CONFIG.PSU__CRF_APB__DBG_TRACE_CTRL__FREQMHZ 250 \
  CONFIG.PSU__CRF_APB__DBG_FPD_CTRL__FREQMHZ 250 \
  CONFIG.PSU__CRF_APB__DDR_CTRL__FREQMHZ 1067 \
  CONFIG.PSU__CRF_APB__GPU_REF_CTRL__FREQMHZ 500 \
  CONFIG.PSU__CRL_APB__PL0_REF_CTRL__FREQMHZ 100 \
  CONFIG.PSU__CRL_APB__PL1_REF_CTRL__FREQMHZ 300 \
  CONFIG.PSU__CRF_APB__GDMA_REF_CTRL__FREQMHZ 600 \
  CONFIG.PSU__CRF_APB__DPDMA_REF_CTRL__FREQMHZ 600 \
  CONFIG.PSU__CRF_APB__TOPSW_MAIN_CTRL__FREQMHZ 533.33 \
  CONFIG.PSU__CRF_APB__TOPSW_LSBUS_CTRL__FREQMHZ 100 \
  CONFIG.PSU__CRF_APB__DBG_TSTMP_CTRL__FREQMHZ 250 \
  CONFIG.PSU__CRL_APB__GEM3_REF_CTRL__FREQMHZ 125 \
  CONFIG.PSU__CRL_APB__USB0_BUS_REF_CTRL__FREQMHZ 250 \
  CONFIG.PSU__CRL_APB__QSPI_REF_CTRL__FREQMHZ 125 \
  CONFIG.PSU__CRL_APB__SDIO1_REF_CTRL__FREQMHZ 200 \
  CONFIG.PSU__CRL_APB__UART0_REF_CTRL__FREQMHZ 100 \
  CONFIG.PSU__CRL_APB__UART1_REF_CTRL__FREQMHZ 100 \
  CONFIG.PSU__CRL_APB__I2C0_REF_CTRL__FREQMHZ 100 \
  CONFIG.PSU__CRL_APB__I2C1_REF_CTRL__FREQMHZ 100 \
  CONFIG.PSU__CRL_APB__CAN1_REF_CTRL__FREQMHZ 100 \
  CONFIG.PSU__CRL_APB__CPU_R5_CTRL__FREQMHZ 500 \
  CONFIG.PSU__CRL_APB__IOU_SWITCH_CTRL__FREQMHZ 250 \
  CONFIG.PSU__CRL_APB__PCAP_CTRL__FREQMHZ 200 \
  CONFIG.PSU__CRL_APB__LPD_LSBUS_CTRL__FREQMHZ 100 \
  CONFIG.PSU__CRL_APB__LPD_SWITCH_CTRL__FREQMHZ 500 \
  CONFIG.PSU__CRL_APB__DBG_LPD_CTRL__FREQMHZ 250 \
  CONFIG.PSU__CRL_APB__ADMA_REF_CTRL__FREQMHZ 500 \
  CONFIG.PSU__CRL_APB__AMS_REF_CTRL__FREQMHZ 52 \
  CONFIG.PSU__CRL_APB__TIMESTAMP_REF_CTRL__FREQMHZ 100 \
  CONFIG.PSU__CRL_APB__USB3_DUAL_REF_CTRL__FREQMHZ 20 \
  CONFIG.PSU__GPIO_EMIO_WIDTH 95 \
  CONFIG.IIC0_BOARD_INTERFACE custom \
  CONFIG.IIC1_BOARD_INTERFACE custom \
  CONFIG.QSPI_BOARD_INTERFACE custom \
  CONFIG.NAND_BOARD_INTERFACE custom \
  CONFIG.SD0_BOARD_INTERFACE custom \
  CONFIG.SD1_BOARD_INTERFACE custom \
  CONFIG.CAN0_BOARD_INTERFACE custom \
  CONFIG.CAN1_BOARD_INTERFACE custom \
  CONFIG.PJTAG_BOARD_INTERFACE custom \
  CONFIG.PMU_BOARD_INTERFACE custom \
  CONFIG.CSU_BOARD_INTERFACE custom \
  CONFIG.SPI0_BOARD_INTERFACE custom \
  CONFIG.SPI1_BOARD_INTERFACE custom \
  CONFIG.UART0_BOARD_INTERFACE custom \
  CONFIG.UART1_BOARD_INTERFACE custom \
  CONFIG.GPIO_BOARD_INTERFACE custom \
  CONFIG.SWDT0_BOARD_INTERFACE custom \
  CONFIG.SWDT1_BOARD_INTERFACE custom \
  CONFIG.TRACE_BOARD_INTERFACE custom \
  CONFIG.TTC0_BOARD_INTERFACE custom \
  CONFIG.TTC1_BOARD_INTERFACE custom \
  CONFIG.TTC2_BOARD_INTERFACE custom \
  CONFIG.TTC3_BOARD_INTERFACE custom \
  CONFIG.GEM0_BOARD_INTERFACE custom \
  CONFIG.GEM1_BOARD_INTERFACE custom \
  CONFIG.GEM2_BOARD_INTERFACE custom \
  CONFIG.GEM3_BOARD_INTERFACE custom \
  CONFIG.USB0_BOARD_INTERFACE custom \
  CONFIG.USB1_BOARD_INTERFACE custom \
  CONFIG.PCIE_BOARD_INTERFACE custom \
  CONFIG.DP_BOARD_INTERFACE custom \
  CONFIG.SATA_BOARD_INTERFACE custom \
  CONFIG.PSU__PMU_COHERENCY 0 \
  CONFIG.PSU__USB0_COHERENCY 0 \
  CONFIG.PSU__SD1_COHERENCY 0 \
  CONFIG.PSU__QSPI_COHERENCY 0 \
  CONFIG.PSU__ENET3__TSU__ENABLE 0 \
  CONFIG.PSU__GEM3_COHERENCY 0 \
] [get_bd_cells zynq_ultra_ps_e_0]
# 714 more settings of zynq_ultra_ps_e_0 are not shown: defaults, MIO pin electricals, DDR timing, and values the tool derives

# ---- hierarchy /tpg_input ----
current_bd_instance /tpg_input
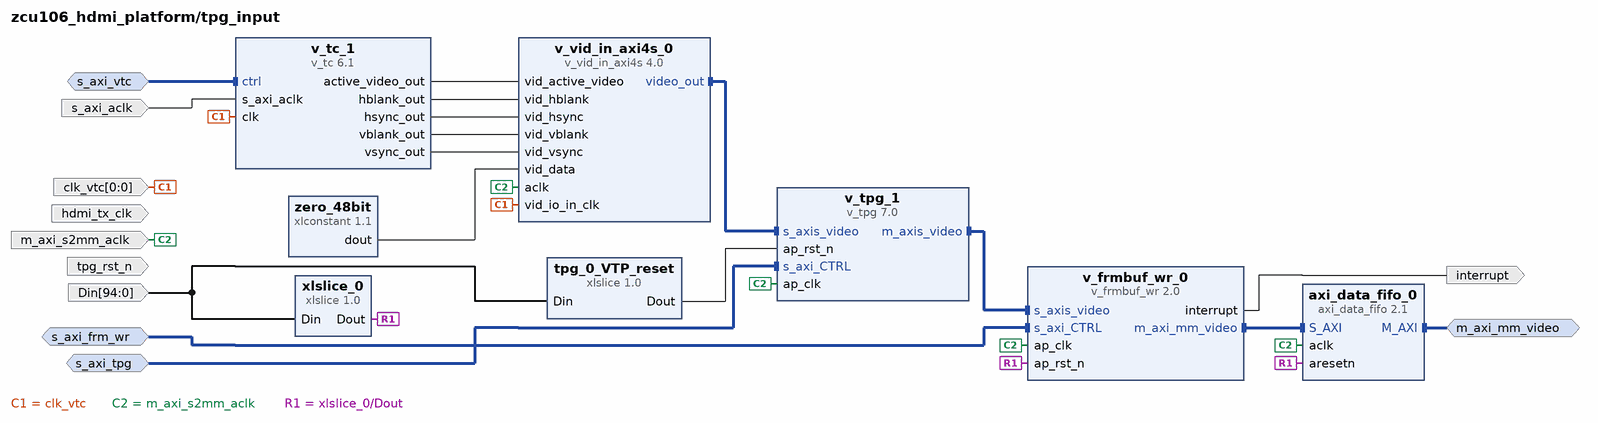
[diagram p6: block diagram inside /tpg_input]
create_bd_intf_pin -mode Master -vlnv xilinx.com:interface:aximm_rtl:1.0 m_axi_mm_video
create_bd_intf_pin -mode Slave -vlnv xilinx.com:interface:aximm_rtl:1.0 s_axi_frm_wr
create_bd_intf_pin -mode Slave -vlnv xilinx.com:interface:aximm_rtl:1.0 s_axi_tpg
create_bd_intf_pin -mode Slave -vlnv xilinx.com:interface:aximm_rtl:1.0 s_axi_vtc
create_bd_pin -dir I -from 94 -to 0 Din
create_bd_pin -dir I -from 0 -to 0 -type clk clk_vtc
create_bd_pin -dir I hdmi_tx_clk
create_bd_pin -dir O -type intr interrupt
create_bd_pin -dir I -type clk m_axi_s2mm_aclk
create_bd_pin -dir I -type clk s_axi_aclk
create_bd_pin -dir I -type rst tpg_rst_n

create_bd_cell -type ip -vlnv xilinx.com:ip:axi_data_fifo:2.1 axi_data_fifo_0
set_property -dict {CONFIG.DATA_WIDTH 128 CONFIG.WRITE_FIFO_DEPTH 512 CONFIG.WRITE_FIFO_DELAY 1} [get_bd_cells axi_data_fifo_0]
create_bd_cell -type ip -vlnv xilinx.com:ip:xlslice:1.0 tpg_0_VTP_reset
set_property -dict {CONFIG.DIN_TO 18 CONFIG.DIN_FROM 18 CONFIG.DIN_WIDTH 95 CONFIG.DOUT_WIDTH 1} [get_bd_cells tpg_0_VTP_reset]
create_bd_cell -type ip -vlnv xilinx.com:ip:v_frmbuf_wr:2.0 v_frmbuf_wr_0
set_property -dict [list \
  CONFIG.C_M_AXI_MM_VIDEO_DATA_WIDTH 128 \
  CONFIG.SAMPLES_PER_CLOCK 2 \
  CONFIG.AXIMM_DATA_WIDTH 128 \
  CONFIG.HAS_Y_UV8 1 \
  CONFIG.HAS_Y_UV8_420 1 \
  CONFIG.MAX_NR_PLANES 2 \
] [get_bd_cells v_frmbuf_wr_0]
create_bd_cell -type ip -vlnv xilinx.com:ip:v_tc:6.1 v_tc_1
set_property -dict [list \
  CONFIG.max_clocks_per_line 8192 \
  CONFIG.max_lines_per_frame 8192 \
  CONFIG.VIDEO_MODE 1080p \
  CONFIG.enable_detection false \
  CONFIG.vertical_blank_generation true \
] [get_bd_cells v_tc_1]
create_bd_cell -type ip -vlnv xilinx.com:ip:v_tpg:7.0 v_tpg_1
set_property -dict [list \
  CONFIG.SAMPLES_PER_CLOCK 2 \
  CONFIG.MAX_COLS 3840 \
  CONFIG.MAX_ROWS 2160 \
  CONFIG.HAS_AXI4S_SLAVE 1 \
] [get_bd_cells v_tpg_1]
create_bd_cell -type ip -vlnv xilinx.com:ip:v_vid_in_axi4s:4.0 v_vid_in_axi4s_0
set_property -dict [list \
  CONFIG.C_PIXELS_PER_CLOCK 2 \
  CONFIG.C_M_AXIS_VIDEO_FORMAT 2 \
  CONFIG.C_HAS_ASYNC_CLK 1 \
  CONFIG.C_ADDR_WIDTH 5 \
] [get_bd_cells v_vid_in_axi4s_0]
create_bd_cell -type ip -vlnv xilinx.com:ip:xlslice:1.0 xlslice_0
set_property -dict {CONFIG.DIN_TO 16 CONFIG.DIN_FROM 16 CONFIG.DIN_WIDTH 95 CONFIG.DOUT_WIDTH 1} [get_bd_cells xlslice_0]
create_bd_cell -type ip -vlnv xilinx.com:ip:xlconstant:1.1 zero_48bit
set_property -dict {CONFIG.CONST_WIDTH 48 CONFIG.CONST_VAL 0} [get_bd_cells zero_48bit]

# ---- connections ----

current_bd_instance /gpio_aresetn
connect_bd_net -net frmbuf_rd_rst_gpio_Dout [get_bd_pins tx_frmbuf_rd_aresetn_1/Dout] [get_bd_pins gpio_1]
connect_bd_net -net frmbuf_wr_rst_gpio_Dout [get_bd_pins rx_scaler_reset/Dout] [get_bd_pins gpio_0]
connect_bd_net -net zynq_ultra_ps_e_0_emio_gpio_o [get_bd_pins Din] [get_bd_pins rx_scaler_reset/Din] [get_bd_pins tx_frmbuf_rd_aresetn_1/Din]

current_bd_instance /gt_refclk_buf
connect_bd_intf_net [get_bd_intf_pins CLK_IN_D] [get_bd_intf_pins ibufds_gt/CLK_IN_D]
connect_bd_net [get_bd_pins const_vcc/dout] [get_bd_pins ibufds_gt_odiv2/BUFG_GT_CE]
connect_bd_net [get_bd_pins ibufds_gt/IBUF_DS_ODIV2] [get_bd_pins ibufds_gt_odiv2/BUFG_GT_I]
connect_bd_net [get_bd_pins ibufds_gt/IBUF_OUT] [get_bd_pins IBUF_OUT]
connect_bd_net [get_bd_pins ibufds_gt_odiv2/BUFG_GT_O] [get_bd_pins BUFG_GT_O]

current_bd_instance /hdmi_input
connect_bd_intf_net [get_bd_intf_pins axi_data_fifo_0/S_AXI] [get_bd_intf_pins v_frmbuf_wr_0/m_axi_mm_video]
connect_bd_intf_net [get_bd_intf_pins v_hdmi_rx_ss_0/VIDEO_OUT] [get_bd_intf_pins v_proc_ss_0/s_axis]
connect_bd_intf_net [get_bd_intf_pins v_frmbuf_wr_0/s_axis_video] [get_bd_intf_pins v_proc_ss_0/m_axis]
connect_bd_intf_net [get_bd_intf_pins DDC] [get_bd_intf_pins v_hdmi_rx_ss_0/DDC_OUT]
connect_bd_intf_net [get_bd_intf_pins LINK_DATA0] [get_bd_intf_pins v_hdmi_rx_ss_0/LINK_DATA0_IN]
connect_bd_intf_net [get_bd_intf_pins LINK_DATA1] [get_bd_intf_pins v_hdmi_rx_ss_0/LINK_DATA1_IN]
connect_bd_intf_net [get_bd_intf_pins LINK_DATA2] [get_bd_intf_pins v_hdmi_rx_ss_0/LINK_DATA2_IN]
connect_bd_intf_net [get_bd_intf_pins M_AXI] [get_bd_intf_pins axi_data_fifo_0/M_AXI]
connect_bd_intf_net [get_bd_intf_pins SB_STATUS] [get_bd_intf_pins v_hdmi_rx_ss_0/SB_STATUS_IN]
connect_bd_intf_net [get_bd_intf_pins S_AXI_CPU] [get_bd_intf_pins v_hdmi_rx_ss_0/S_AXI_CPU_IN]
connect_bd_intf_net [get_bd_intf_pins s_axi_CTRL] [get_bd_intf_pins v_frmbuf_wr_0/s_axi_CTRL]
connect_bd_intf_net [get_bd_intf_pins s_axi_ctrl_0] [get_bd_intf_pins v_proc_ss_0/s_axi_ctrl]
connect_bd_net [get_bd_pins Din] [get_bd_pins xlslice_1/Din]
connect_bd_net [get_bd_pins aresetn_100M] [get_bd_pins v_hdmi_rx_ss_0/s_axi_cpu_aresetn]
connect_bd_net [get_bd_pins aresetn_300M] [get_bd_pins v_hdmi_rx_ss_0/s_axis_video_aresetn]
connect_bd_net [get_bd_pins cable_detect] [get_bd_pins v_hdmi_rx_ss_0/cable_detect]
connect_bd_net [get_bd_pins clk_100M] [get_bd_pins v_hdmi_rx_ss_0/s_axi_cpu_aclk] [get_bd_pins v_hdmi_rx_ss_0/s_axis_audio_aclk]
connect_bd_net [get_bd_pins clk_300M] \
  [get_bd_pins axi_data_fifo_0/aclk] [get_bd_pins v_frmbuf_wr_0/ap_clk] [get_bd_pins v_hdmi_rx_ss_0/s_axis_video_aclk] \
  [get_bd_pins v_proc_ss_0/aclk_axis] [get_bd_pins v_proc_ss_0/aclk_ctrl]
connect_bd_net [get_bd_pins link_clk] [get_bd_pins v_hdmi_rx_ss_0/link_clk]
connect_bd_net -net rx_scaler_reset [get_bd_pins frmbuf_aresetn] [get_bd_pins v_proc_ss_0/aresetn_ctrl]
connect_bd_net [get_bd_pins v_frmbuf_wr_0/interrupt] [get_bd_pins interrupt]
connect_bd_net [get_bd_pins v_hdmi_rx_ss_0/hpd] [get_bd_pins hpd]
connect_bd_net [get_bd_pins v_hdmi_rx_ss_0/irq] [get_bd_pins irq]
connect_bd_net [get_bd_pins video_clk] [get_bd_pins v_hdmi_rx_ss_0/video_clk]
connect_bd_net [get_bd_pins xlslice_1/Dout] [get_bd_pins axi_data_fifo_0/aresetn] [get_bd_pins v_frmbuf_wr_0/ap_rst_n]

current_bd_instance /hdmi_output
connect_bd_intf_net [get_bd_intf_pins v_frmbuf_rd_0/m_axis_video] [get_bd_intf_pins v_mix_0/s_axis_video]
connect_bd_intf_net [get_bd_intf_pins v_hdmi_tx_ss_0/VIDEO_IN] [get_bd_intf_pins v_mix_0/m_axis_video]
connect_bd_intf_net [get_bd_intf_pins DDC] [get_bd_intf_pins v_hdmi_tx_ss_0/DDC_OUT]
connect_bd_intf_net [get_bd_intf_pins LINK_DATA0] [get_bd_intf_pins v_hdmi_tx_ss_0/LINK_DATA0_OUT]
connect_bd_intf_net [get_bd_intf_pins LINK_DATA1] [get_bd_intf_pins v_hdmi_tx_ss_0/LINK_DATA1_OUT]
connect_bd_intf_net [get_bd_intf_pins LINK_DATA2] [get_bd_intf_pins v_hdmi_tx_ss_0/LINK_DATA2_OUT]
connect_bd_intf_net [get_bd_intf_pins SB_STATUS] [get_bd_intf_pins v_hdmi_tx_ss_0/SB_STATUS_IN]
connect_bd_intf_net [get_bd_intf_pins S_AXI_CPU] [get_bd_intf_pins v_hdmi_tx_ss_0/S_AXI_CPU_IN]
connect_bd_intf_net [get_bd_intf_pins m_axi_mm_video1_0] [get_bd_intf_pins v_mix_0/m_axi_mm_video1]
connect_bd_intf_net [get_bd_intf_pins m_axi_mm_video2_0] [get_bd_intf_pins v_mix_0/m_axi_mm_video2]
connect_bd_intf_net [get_bd_intf_pins m_axi_mm_video3_0] [get_bd_intf_pins v_mix_0/m_axi_mm_video3]
connect_bd_intf_net [get_bd_intf_pins m_axi_mm_video4_0] [get_bd_intf_pins v_mix_0/m_axi_mm_video4]
connect_bd_intf_net [get_bd_intf_pins m_axi_mm_video5_0] [get_bd_intf_pins v_mix_0/m_axi_mm_video5]
connect_bd_intf_net [get_bd_intf_pins m_axi_mm_video6_0] [get_bd_intf_pins v_mix_0/m_axi_mm_video6]
connect_bd_intf_net [get_bd_intf_pins m_axi_mm_video7_0] [get_bd_intf_pins v_mix_0/m_axi_mm_video7]
connect_bd_intf_net [get_bd_intf_pins m_axi_mm_video_0] [get_bd_intf_pins v_frmbuf_rd_0/m_axi_mm_video]
connect_bd_intf_net [get_bd_intf_pins s_axi_ctrl_frm_rd] [get_bd_intf_pins v_frmbuf_rd_0/s_axi_CTRL]
connect_bd_intf_net [get_bd_intf_pins s_axi_ctrl_mixer] [get_bd_intf_pins v_mix_0/s_axi_CTRL]
connect_bd_net [get_bd_pins Din] [get_bd_pins mixer_rst/Din]
connect_bd_net [get_bd_pins aresetn_100M] [get_bd_pins v_hdmi_tx_ss_0/s_axi_cpu_aresetn]
connect_bd_net [get_bd_pins aresetn_300M] [get_bd_pins v_hdmi_tx_ss_0/s_axis_video_aresetn]
connect_bd_net [get_bd_pins clk_100M] [get_bd_pins v_hdmi_tx_ss_0/s_axi_cpu_aclk] [get_bd_pins v_hdmi_tx_ss_0/s_axis_audio_aclk]
connect_bd_net [get_bd_pins clk_300M] [get_bd_pins v_frmbuf_rd_0/ap_clk] [get_bd_pins v_hdmi_tx_ss_0/s_axis_video_aclk] [get_bd_pins v_mix_0/ap_clk]
connect_bd_net [get_bd_pins frmbuf_aresetn] [get_bd_pins v_frmbuf_rd_0/ap_rst_n]
connect_bd_net [get_bd_pins hpd] [get_bd_pins v_hdmi_tx_ss_0/hpd]
connect_bd_net [get_bd_pins mixer_rst/Dout] [get_bd_pins v_mix_0/ap_rst_n]
connect_bd_net [get_bd_pins v_frmbuf_rd_0/interrupt] [get_bd_pins interrupt_frm_rd]
connect_bd_net [get_bd_pins v_hdmi_tx_ss_0/irq] [get_bd_pins interrupt_hdmi_tx]
connect_bd_net [get_bd_pins v_hdmi_tx_ss_0/locked] [get_bd_pins locked]
connect_bd_net [get_bd_pins v_mix_0/interrupt] [get_bd_pins interrupt_mixer]
connect_bd_net -net vid_phy_controller_0_tx_video_clk [get_bd_pins video_clk] [get_bd_pins v_hdmi_tx_ss_0/video_clk]
connect_bd_net -net vid_phy_controller_0_txoutclk [get_bd_pins link_clk] [get_bd_pins v_hdmi_tx_ss_0/link_clk]

current_bd_instance /mpsoc_ss
connect_bd_intf_net [get_bd_intf_pins axi_interconnect/M04_AXI] [get_bd_intf_pins hdmi_ctrl_iic/S_AXI]
connect_bd_intf_net [get_bd_intf_pins axi_interconnect/S00_AXI] [get_bd_intf_pins zynq_ultra_ps_e_0/M_AXI_HPM0_FPD]
connect_bd_intf_net [get_bd_intf_pins IIC] [get_bd_intf_pins hdmi_ctrl_iic/IIC]
connect_bd_intf_net [get_bd_intf_pins M00_AXI] [get_bd_intf_pins axi_interconnect/M00_AXI]
connect_bd_intf_net [get_bd_intf_pins M01_AXI] [get_bd_intf_pins axi_interconnect/M01_AXI]
connect_bd_intf_net [get_bd_intf_pins M02_AXI] [get_bd_intf_pins axi_interconnect/M02_AXI]
connect_bd_intf_net [get_bd_intf_pins M03_AXI] [get_bd_intf_pins axi_interconnect/M03_AXI]
connect_bd_intf_net [get_bd_intf_pins M05_AXI] [get_bd_intf_pins axi_interconnect/M05_AXI]
connect_bd_intf_net [get_bd_intf_pins M06_AXI] [get_bd_intf_pins axi_interconnect/M06_AXI]
connect_bd_intf_net [get_bd_intf_pins M07_AXI_0] [get_bd_intf_pins axi_interconnect/M07_AXI]
connect_bd_intf_net [get_bd_intf_pins M08_AXI_0] [get_bd_intf_pins axi_interconnect/M08_AXI]
connect_bd_intf_net [get_bd_intf_pins M09_AXI_0] [get_bd_intf_pins axi_interconnect/M09_AXI]
connect_bd_intf_net [get_bd_intf_pins M10_AXI_0] [get_bd_intf_pins axi_interconnect/M10_AXI]
connect_bd_intf_net [get_bd_intf_pins M11_AXI_0] [get_bd_intf_pins axi_interconnect/M11_AXI]
connect_bd_intf_net [get_bd_intf_pins S_AXI_HP0_FPD] [get_bd_intf_pins zynq_ultra_ps_e_0/S_AXI_HP0_FPD]
connect_bd_intf_net [get_bd_intf_pins S_AXI_HP1_FPD_0] [get_bd_intf_pins zynq_ultra_ps_e_0/S_AXI_HP1_FPD]
connect_bd_intf_net [get_bd_intf_pins S_AXI_HP2_FPD_0] [get_bd_intf_pins zynq_ultra_ps_e_0/S_AXI_HP2_FPD]
connect_bd_intf_net [get_bd_intf_pins S_AXI_HP3_FPD_0] [get_bd_intf_pins zynq_ultra_ps_e_0/S_AXI_HP3_FPD]
connect_bd_intf_net [get_bd_intf_pins S_AXI_HPC0_FPD_0] [get_bd_intf_pins zynq_ultra_ps_e_0/S_AXI_HPC0_FPD]
connect_bd_net -net ARESETN_1 [get_bd_pins proc_sys_reset_0/interconnect_aresetn] [get_bd_pins axi_interconnect/ARESETN]
connect_bd_net -net M17_ARESETN_1 [get_bd_pins reset_333] \
  [get_bd_pins axi_interconnect/M03_ARESETN] [get_bd_pins axi_interconnect/M05_ARESETN] \
  [get_bd_pins axi_interconnect/M06_ARESETN] [get_bd_pins axi_interconnect/M07_ARESETN] \
  [get_bd_pins axi_interconnect/M09_ARESETN] [get_bd_pins axi_interconnect/M10_ARESETN]
connect_bd_net [get_bd_pins hdmi_ctrl_iic/iic2intc_irpt] [get_bd_pins iic2intc_irpt]
connect_bd_net -net net_clk_wiz_clk_out1 [get_bd_pins zynq_ultra_ps_e_0/pl_clk0] \
  [get_bd_pins clk_100M] [get_bd_pins axi_interconnect/ACLK] [get_bd_pins axi_interconnect/M00_ACLK] \
  [get_bd_pins axi_interconnect/M01_ACLK] [get_bd_pins axi_interconnect/M02_ACLK] [get_bd_pins axi_interconnect/M04_ACLK] \
  [get_bd_pins axi_interconnect/M08_ACLK] [get_bd_pins axi_interconnect/M11_ACLK] [get_bd_pins axi_interconnect/S00_ACLK] \
  [get_bd_pins hdmi_ctrl_iic/s_axi_aclk] [get_bd_pins proc_sys_reset_0/slowest_sync_clk] \
  [get_bd_pins zynq_ultra_ps_e_0/maxihpm0_fpd_aclk]
connect_bd_net -net net_rst_processor_1_100M_peripheral_aresetn [get_bd_pins proc_sys_reset_0/peripheral_aresetn] \
  [get_bd_pins aresetn_100M] [get_bd_pins axi_interconnect/M00_ARESETN] [get_bd_pins axi_interconnect/M01_ARESETN] \
  [get_bd_pins axi_interconnect/M02_ARESETN] [get_bd_pins axi_interconnect/M04_ARESETN] \
  [get_bd_pins axi_interconnect/M08_ARESETN] [get_bd_pins axi_interconnect/M11_ARESETN] \
  [get_bd_pins axi_interconnect/S00_ARESETN] [get_bd_pins hdmi_ctrl_iic/s_axi_aresetn]
connect_bd_net -net pl_ps_irq0_1 [get_bd_pins pl_ps_irq0] [get_bd_pins zynq_ultra_ps_e_0/pl_ps_irq0]
connect_bd_net -net pl_ps_irq1_0_1 [get_bd_pins pl_ps_irq1] [get_bd_pins zynq_ultra_ps_e_0/pl_ps_irq1]
connect_bd_net -net saxihp2_fpd_aclk_0_1 [get_bd_pins s_axi_hpc0_fpd_aclk] \
  [get_bd_pins axi_interconnect/M03_ACLK] [get_bd_pins axi_interconnect/M05_ACLK] [get_bd_pins axi_interconnect/M06_ACLK] \
  [get_bd_pins axi_interconnect/M07_ACLK] [get_bd_pins axi_interconnect/M09_ACLK] [get_bd_pins axi_interconnect/M10_ACLK] \
  [get_bd_pins zynq_ultra_ps_e_0/saxihp0_fpd_aclk] [get_bd_pins zynq_ultra_ps_e_0/saxihp1_fpd_aclk] \
  [get_bd_pins zynq_ultra_ps_e_0/saxihp2_fpd_aclk] [get_bd_pins zynq_ultra_ps_e_0/saxihp3_fpd_aclk] \
  [get_bd_pins zynq_ultra_ps_e_0/saxihpc0_fpd_aclk]
connect_bd_net [get_bd_pins zynq_ultra_ps_e_0/emio_gpio_o] [get_bd_pins gpio]
connect_bd_net [get_bd_pins zynq_ultra_ps_e_0/pl_resetn0] [get_bd_pins pl_resetn0_0] [get_bd_pins proc_sys_reset_0/ext_reset_in]

current_bd_instance /tpg_input
connect_bd_intf_net [get_bd_intf_pins axi_data_fifo_0/S_AXI] [get_bd_intf_pins v_frmbuf_wr_0/m_axi_mm_video]
connect_bd_intf_net [get_bd_intf_pins v_frmbuf_wr_0/s_axis_video] [get_bd_intf_pins v_tpg_1/m_axis_video]
connect_bd_intf_net [get_bd_intf_pins v_tpg_1/s_axis_video] [get_bd_intf_pins v_vid_in_axi4s_0/video_out]
connect_bd_intf_net [get_bd_intf_pins m_axi_mm_video] [get_bd_intf_pins axi_data_fifo_0/M_AXI]
connect_bd_intf_net [get_bd_intf_pins s_axi_frm_wr] [get_bd_intf_pins v_frmbuf_wr_0/s_axi_CTRL]
connect_bd_intf_net [get_bd_intf_pins s_axi_tpg] [get_bd_intf_pins v_tpg_1/s_axi_CTRL]
connect_bd_intf_net [get_bd_intf_pins s_axi_vtc] [get_bd_intf_pins v_tc_1/ctrl]
connect_bd_net [get_bd_pins Din] [get_bd_pins tpg_0_VTP_reset/Din] [get_bd_pins xlslice_0/Din]
connect_bd_net -net clk_50mhz [get_bd_pins s_axi_aclk] [get_bd_pins v_tc_1/s_axi_aclk]
connect_bd_net -net fmc_hdmi_input_clk_out [get_bd_pins clk_vtc] [get_bd_pins v_tc_1/clk] [get_bd_pins v_vid_in_axi4s_0/vid_io_in_clk]
connect_bd_net [get_bd_pins m_axi_s2mm_aclk] \
  [get_bd_pins axi_data_fifo_0/aclk] [get_bd_pins v_frmbuf_wr_0/ap_clk] [get_bd_pins v_tpg_1/ap_clk] \
  [get_bd_pins v_vid_in_axi4s_0/aclk]
connect_bd_net [get_bd_pins tpg_0_VTP_reset/Dout] [get_bd_pins v_tpg_1/ap_rst_n]
connect_bd_net [get_bd_pins v_frmbuf_wr_0/interrupt] [get_bd_pins interrupt]
connect_bd_net [get_bd_pins v_tc_1/active_video_out] [get_bd_pins v_vid_in_axi4s_0/vid_active_video]
connect_bd_net [get_bd_pins v_tc_1/hblank_out] [get_bd_pins v_vid_in_axi4s_0/vid_hblank]
connect_bd_net [get_bd_pins v_tc_1/hsync_out] [get_bd_pins v_vid_in_axi4s_0/vid_hsync]
connect_bd_net [get_bd_pins v_tc_1/vblank_out] [get_bd_pins v_vid_in_axi4s_0/vid_vblank]
connect_bd_net [get_bd_pins v_tc_1/vsync_out] [get_bd_pins v_vid_in_axi4s_0/vid_vsync]
connect_bd_net [get_bd_pins xlslice_0/Dout] [get_bd_pins axi_data_fifo_0/aresetn] [get_bd_pins v_frmbuf_wr_0/ap_rst_n]
connect_bd_net -net zero_24bit_dout [get_bd_pins zero_48bit/dout] [get_bd_pins v_vid_in_axi4s_0/vid_data]
